# EAGLE design gate-feather (EAGLE 9.6.2)
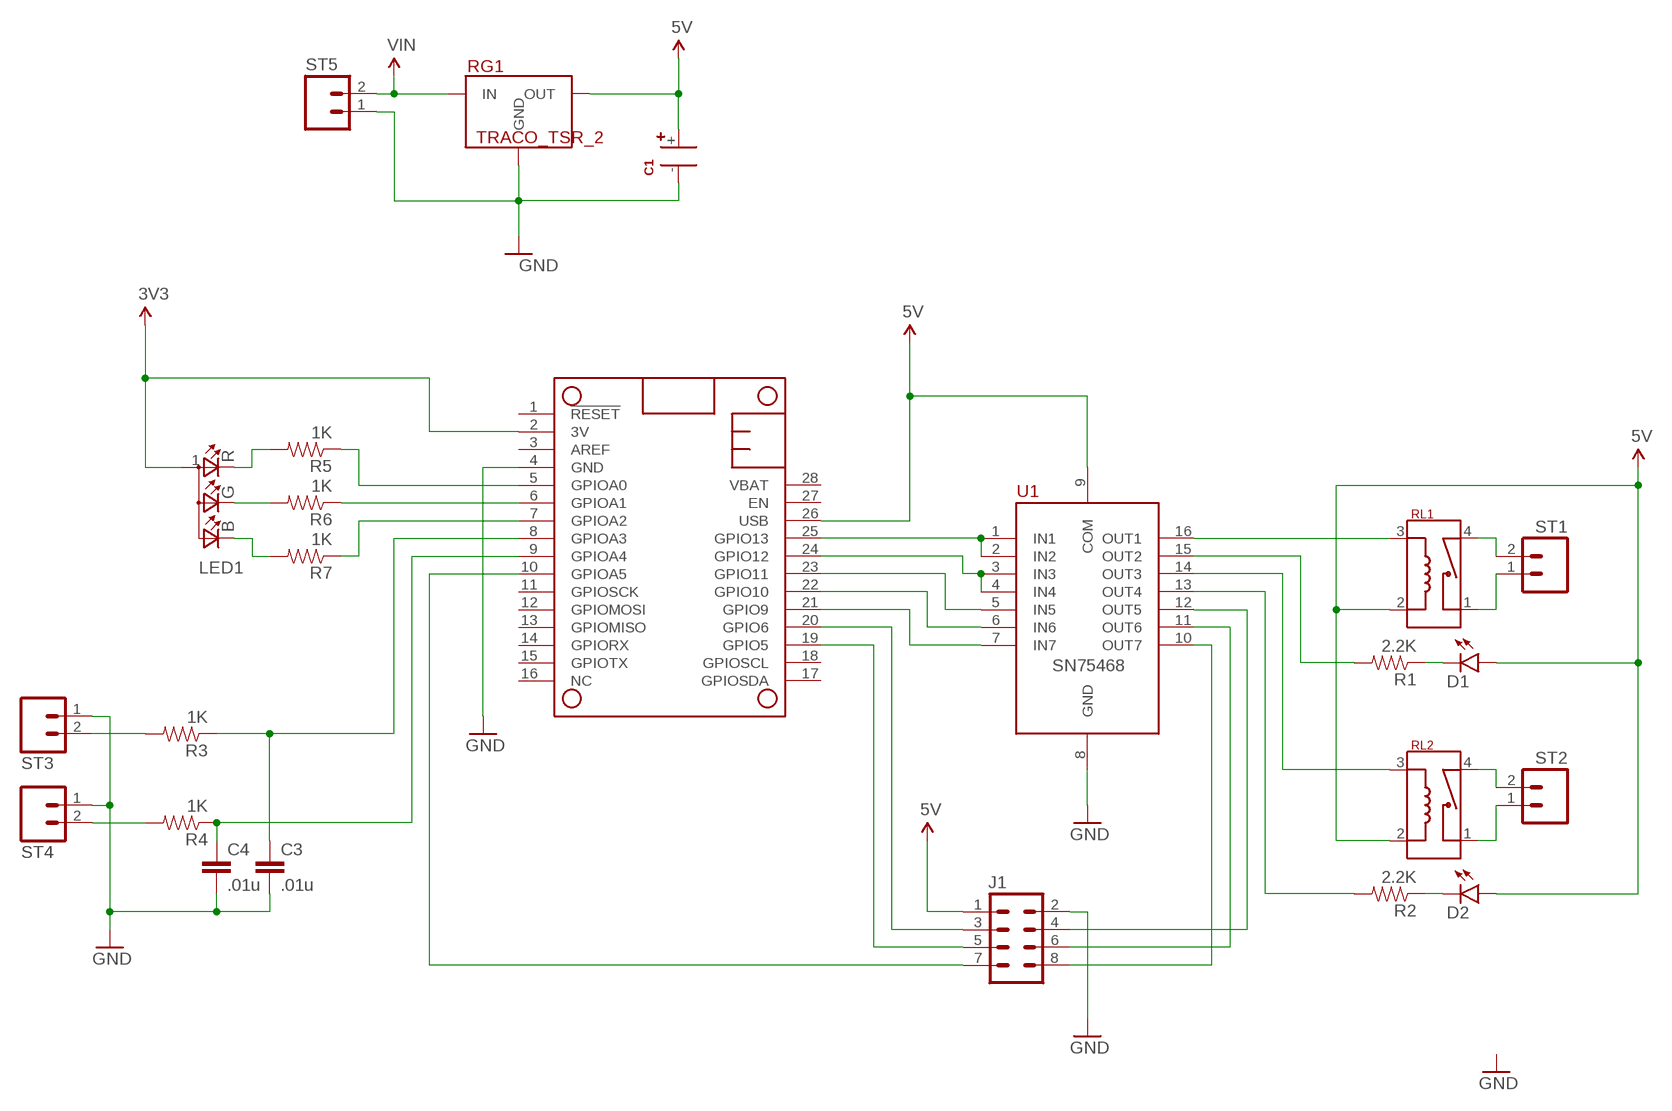
[diagram p0: schematic, sheet 1]

## Parts
C1  CAPACITOR-AXIAL10X25  [CAP-AXIAL-10X25]
C3  .01u  CAP0603-CAP  [0603-CAP]
C4  .01u  CAP0603-CAP  [0603-CAP]
D1  LED0603  [LED-0603]
D2  LED0603  [LED-0603]
J1  M04X2  [2X4]
LED1  LED-RGB-CREE-SMD  [LED-RGB-CREE-SMD]
MS1  FEATHERWING_NODIM  [FEATHERWING_DIM]
R1  2.2K  RESISTOR0603  [0603-RES]
R2  2.2K  RESISTOR0603  [0603-RES]
R3  1K  RESISTOR0603  [0603-RES]
R4  1K  RESISTOR0603  [0603-RES]
R5  1K  RESISTOR0603  [0603-RES]
R6  1K  RESISTOR0603  [0603-RES]
R7  1K  RESISTOR0603  [0603-RES]
RG1  TRACO_TSR_2  [TRACO_TSR_2]
RL1  HE3600_RELAY  [HE3600_RELAY]
RL2  HE3600_RELAY  [HE3600_RELAY]
ST1  SCREWTERM_2  [SCREWTERM_0.2X2]
ST2  SCREWTERM_2  [SCREWTERM_0.2X2]
ST3  SCREWTERM_2  [SCREWTERM_0.2X2]
ST4  SCREWTERM_2  [SCREWTERM_0.2X2]
ST5  SCREWTERM_2  [SCREWTERM_0.2X2]
U1  SN75468  [SOIC16]

## Nets
3V3: LED1.1(A) MS1.2(3V)
5V: C1.+ D1.A D2.A J1.1 MS1.26(USB) RG1.3(OUT) RL1.2(R1) RL2.2(R1) U1.9(COM)
GND: C1.- C3.2 C4.2 J1.2 MS1.4(GND) RG1.2(GND) ST3.1 ST4.1 ST5.1 U1.8(GND)
L5: J1.4 U1.12(OUT5)
L6: J1.6 U1.11(OUT6)
L7: J1.8 U1.10(OUT7)
N$1: D2.C R2.1
N$2: RL1.4(C2) ST1.2
N$3: D1.C R1.1
N$4: RL2.4(C2) ST2.2
N$5: R2.2 U1.13(OUT4)
N$6: R1.2 U1.15(OUT2)
N$7: C4.1 MS1.9(GPIOA4) R4.1
N$8: MS1.23(GPIO11) U1.5(IN5)
N$9: RL2.1(C1) ST2.1
N$10: LED1.4(R) R5.2
N$11: LED1.3(G) R6.2
N$12: LED1.2(B) R7.2
N$13: RL1.1(C1) ST1.1
N$15: MS1.6(GPIOA1) R6.1
N$16: MS1.5(GPIOA0) R5.1
N$17: R4.2 ST4.2
N$18: R3.2 ST3.2
N$19: MS1.7(GPIOA2) R7.1
N$20: J1.3 MS1.20(GPIO6)
N$21: MS1.22(GPIO10) U1.6(IN6)
N$22: RL2.3(R2) U1.14(OUT3)
N$23: MS1.21(GPIO9) U1.7(IN7)
N$24: J1.5 MS1.19(GPIO5)
N$25: J1.7 MS1.10(GPIOA5)
N$26: MS1.25(GPIO13) U1.1(IN1) U1.2(IN2)
N$27: MS1.24(GPIO12) U1.3(IN3) U1.4(IN4)
N$31: C3.1 MS1.8(GPIOA3) R3.1
N$33: RL1.3(R2) U1.16(OUT1)
VIN: RG1.1(IN) ST5.2
Unconnected: MS1.1(!RESET) MS1.3(AREF) MS1.11(GPIOSCK) MS1.12(GPIOMOSI) MS1.13(GPIOMISO) MS1.14(GPIORX) MS1.15(GPIOTX) MS1.16(NC) MS1.17(GPIOSDA) MS1.18(GPIOSCL) MS1.27(EN) MS1.28(VBAT)

## Library data of the parts
C1 = Puffin:CAPACITOR-AXIAL
C3 C4 = SparkFun-Capacitors:CAP: Capacitor Standard 0603 ceramic capacitor, and 0.1" leaded capacitor.
D1 D2 = SparkFun-LED:LED: LEDs Standard schematic elements and footprints for 5mm, 3mm, 1206, and 0603 sized LEDs. 5mm - Spark Fun Electronics SKU : COM-00529 (and others)
J1 = SparkFun-Connectors:M04X2: .1" header, two rows of four.
LED1 = SomUSB1:LED-RGB-CREE-SMD: LED RGB DIFFUSED 4SMD $ 0.35 Cree CLMVB-FKA-CFHEHLCBB7A363 2mm 4-PLCC common anode RGB LED https://www.digikey.com/product-detail/en/cree-inc/CLMVB-FKA-CFHEHLCBB7A363/CLMVB-FKA-CFHEHLCBB7A363CT-ND/6138627 Red=68 ohm, Green/Blue=33 ohm @ 3.3V
MS1 = adafruit:FEATHERWING
R1-R7 = SparkFun-Resistors:RESISTOR: Resistor Basic schematic elements and footprints for 0603, 1206, and PTH resistors.
RG1 = Puffin:TRACO_TSR_2
RL1 RL2 = Puffin:HE3600_RELAY
ST1-ST5 = Puffin:SCREWTERM_2
U1 = Puffin:SN75468

## Board
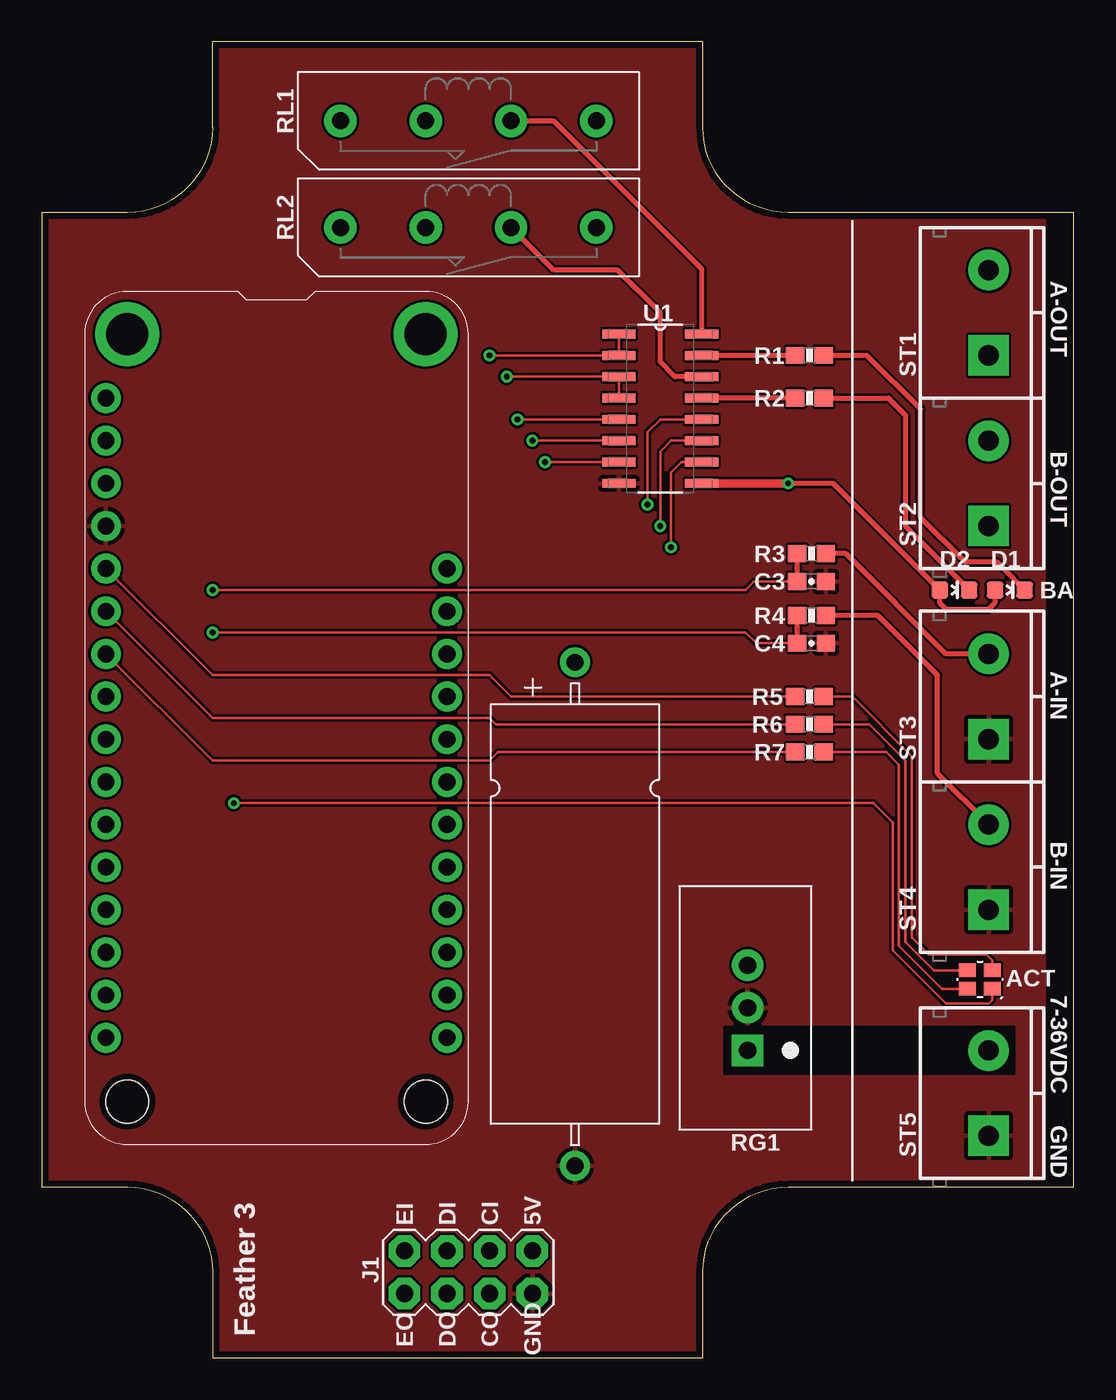
[diagram p1: board, top side]
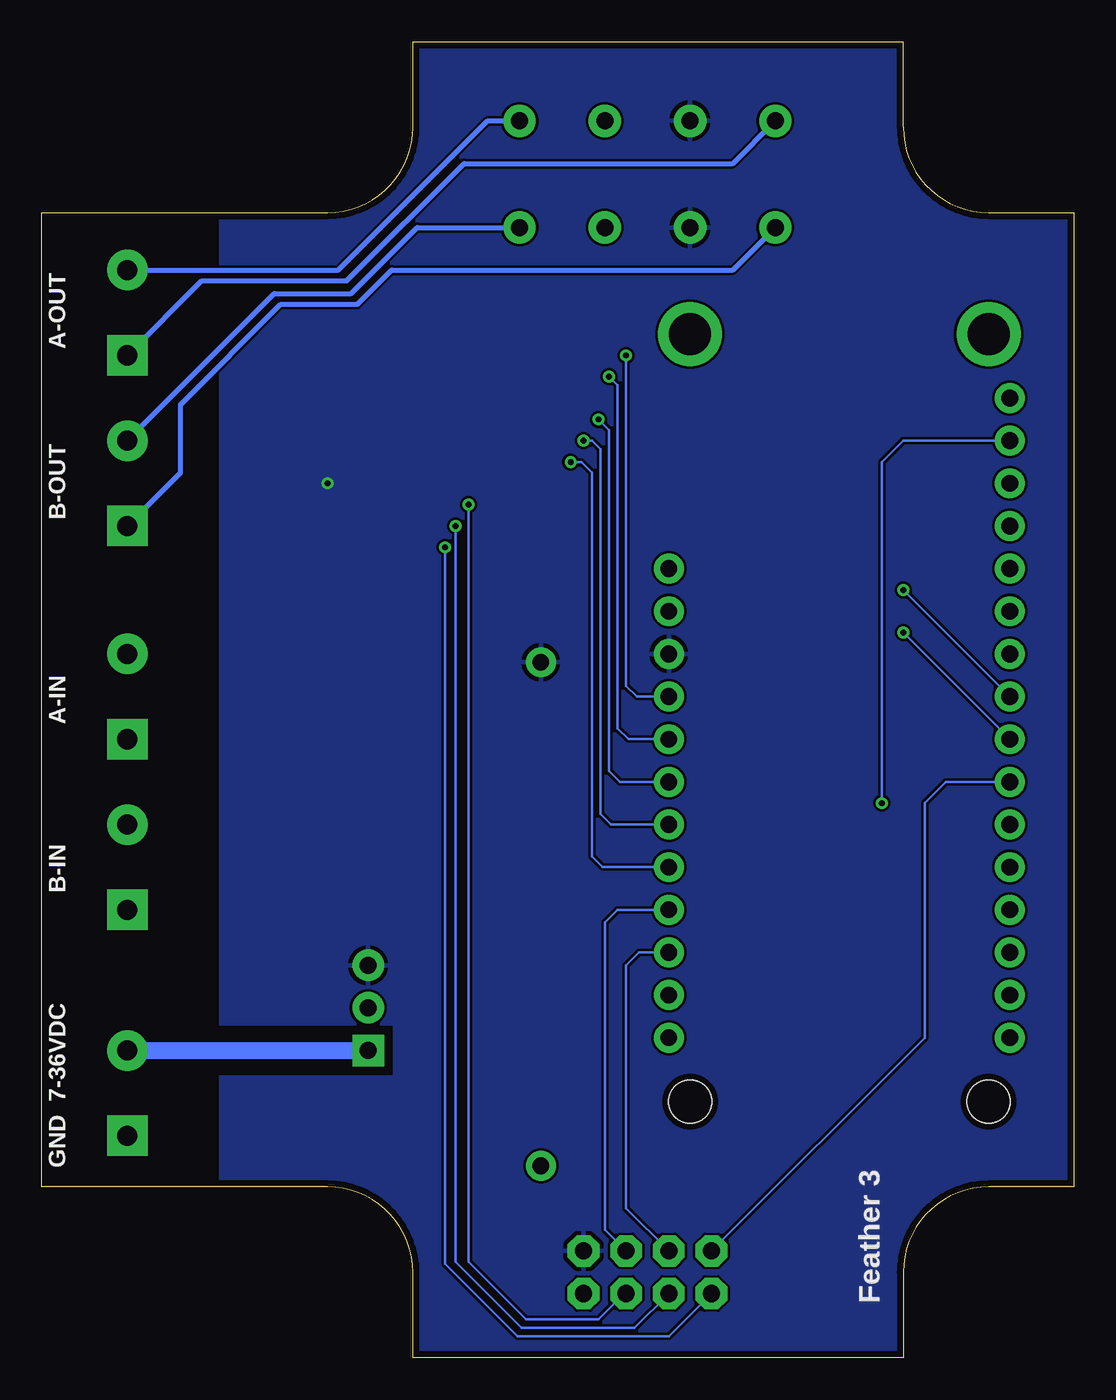
[diagram p2: board, bottom side, seen from below]

Size 61.47 x 78.36 mm. Coordinates in mm from the lower left corner, seen from the top.
Outline: 39.37,73.28 39.37,78.36 10.16,78.36 10.16,73.28 arc-90 5.08,68.2 0,68.2 0,10.16 5.08,10.16 arc-90 10.16,5.08 10.16,0 39.37,0 39.37,5.08 arc-90 44.45,10.16 61.47,10.16 61.47,68.2 44.45,68.2
Outline: 44.45,68.2 arc-90 39.37,73.28
Outline: 44.45,68.2 arc-90 39.37,73.28
Copper layers (1*16): Top 0.0356mm / dielectric 1.5011mm / Bottom 0.0356mm
Design rules "oshpark-2layer": minimum track width 6mil, minimum drill 13mil, track to track 6mil, track to pad 6mil, pad to pad 6mil, via to via 6mil, smd to smd 6mil, copper to edge 15mil, drill to drill 6mil, minimum pad ring 7mil, minimum via ring 7mil, stop-mask expansion 2.5mil, vias tented up to drill 0mil, thermal gap 10mil
tRestrict: area 40.6,16.9 to 57.9,19.7
bRestrict: area 40.6,16.9 to 51.1,19.7

### Footprints (pad centres in the part's own frame; a part is rotated, then mirrored left to right if it is on the bottom)
CAP-AXIAL-10X25 = drill 1 pad 1.778: + 15,0; - -15,0
0603-CAP = smd 1.1 x 1: 1 -0.85,0; 2 0.85,0
LED-0603 = smd 1 x 1: A 0,-0.877; C 0,0.877
2X4 = drill 1.016 pad 1.88 octagon: 1 -3.81,-1.27; 2 -3.81,1.27; 3 -1.27,-1.27; 4 -1.27,1.27; 5 1.27,-1.27; 6 1.27,1.27; 7 3.81,-1.27; 8 3.81,1.27
LED-RGB-CREE-SMD = smd 1 x 0.8: 1 1.5,0; 2 0,0; 3 0,1.1; 4 1.5,1.1
FEATHERWING_DIM = drill 1 pad 1.778: 1 6.35,1.27; 2 8.89,1.27; 3 11.43,1.27; 4 13.97,1.27; 5 16.51,1.27; 6 19.05,1.27; 7 21.59,1.27; 8 24.13,1.27; 9 26.67,1.27; 10 29.21,1.27; 11 31.75,1.27; 12 34.29,1.27; 13 36.83,1.27; 14 39.37,1.27; 15 41.91,1.27; 16 44.45,1.27; 17 44.45,21.59; 18 41.91,21.59; 19 39.37,21.59; 20 36.83,21.59; 21 34.29,21.59; 22 31.75,21.59; 23 29.21,21.59; 24 26.67,21.59; 25 24.13,21.59; 26 21.59,21.59; 27 19.05,21.59; 28 16.51,21.59 | drill 2.5 pad 3.81: P$1 2.54,20.32; P$2 2.54,2.54 | hole 2.54: 48.26,20.32; 48.26,2.54
0603-RES = smd 1.1 x 1: 1 -0.85,0; 2 0.85,0
TRACO_TSR_2 = drill 1.016 pad 1.88 square: 1 -2.54,0 | drill 1.016 pad 1.88: 2 0,0; 3 2.54,0
HE3600_RELAY = drill 1.016 pad 1.93: 1 0,0; 2 0,-5.08; 3 0,-10.16; 4 0,-15.24
SCREWTERM_0.2X2 = drill 1.2 pad 2.413 square: 1 0,0 | drill 1.2 pad 2.413: 2 5.08,0
SOIC16 = smd 1.981 x 0.533: 1 -2.464,4.445; 2 -2.464,3.175; 3 -2.464,1.905; 4 -2.464,0.635; 5 -2.464,-0.635; 6 -2.464,-1.905; 7 -2.464,-3.175; 8 -2.464,-4.445; 9 2.464,-4.445; 10 2.464,-3.175; 11 2.464,-1.905; 12 2.464,-0.635; 13 2.464,0.635; 14 2.464,1.905; 15 2.464,3.175; 16 2.464,4.445

### Placement (x,y rotation side)
C1  31.75,26.42 90 top
C3  45.85,46.23 0 top
C4  45.85,42.55 0 top
D1  57.66,45.72 270 top
D2  54.36,45.72 270 top
J1  25.4,5.08 180 top
LED1  55.12,21.97 0 top
MS1  2.54,63.5 270 top
R1  45.72,59.69 180 top
R2  45.72,57.15 180 top
R3  45.85,47.88 0 top
R4  45.85,44.2 0 top
R5  45.72,39.37 0 top
R6  45.72,37.72 0 top
R7  45.72,36.07 0 top
RG1  42.04,20.83 90 top
RL1  17.78,73.66 90 top
RL2  17.78,67.31 90 top
ST1  56.39,59.69 90 top
ST2  56.39,49.53 90 top
ST3  56.39,36.83 90 top
ST4  56.39,26.67 90 top
ST5  56.39,13.21 90 top
U1  36.83,56.52 0 top

### Tracks (layer width: path | path; a pad name or v marks a point on that pad's centre or on a via)
3V3  (via drill 0.35)
  Top 0.152: LED1.1 56.62,21.31 56.39,21.08 53.85,21.08 50.67,24.26 50.67,31.88 49.53,33.02 v11.43,33.02
  Bottom 0.152: v11.43,33.02 11.43,53.34 10.16,54.61 MS1.2
5V  (via drill 0.35)
  Top 0.305: D1.A 56.78,44.97 56.39,44.58 53.85,44.58 53.48,44.95 D2.A 47.13,52.07 v44.45,52.07
  Top 0.508: U1.9 v44.45,52.07
  pour Bottom: -1.27,80.01 -1.27,-1.27 50.8,-1.27 50.8,80.01
GND
  pour Top: 0,81.28 0,-1.27 59.69,-1.27 59.69,81.28
L5  (via drill 0.35)
  Top 0.152: U1.12 36.83,55.88 36.07,55.12 v36.07,50.8
  Bottom 0.152: v36.07,50.8 36.07,5.71 32.64,2.29 28.32,2.29 26.8,3.81 J1.4
L6  (via drill 0.35)
  Top 0.152: U1.11 37.47,54.61 36.83,53.98 v36.83,49.53
  Bottom 0.152: v36.83,49.53 36.83,5.71 32.89,1.78 26.16,1.78 J1.6
L7  (via drill 0.35)
  Top 0.152: U1.10 38.1,53.34 37.47,52.7 v37.47,48.26
  Bottom 0.152: v37.47,48.26 37.47,5.59 33.15,1.27 24.13,1.27 J1.8
N$1
  Top 0.305: R2.1 50.42,57.15 51.44,56.13 51.44,49.52 D2.C
N$2
  Bottom 0.305: ST1.2 43.81,64.77 34.92,73.66 RL1.4
N$3
  Top 0.305: D1.C 57.29,46.99 56.91,47.37 54.99,47.37 52.32,50.04 52.32,56.52 49.15,59.69 R1.1
N$4
  Bottom 0.305: ST2.2 47.62,63.37 43.05,63.37 39.12,67.31 RL2.4
N$5
  Top 0.305: R2.2 U1.13
N$6
  Top 0.305: R1.2 U1.15
N$7  (via drill 0.35)
  Top 0.152: C4.1 42.55,42.55 41.91,43.18 v10.16,43.18
  Top 0.305: C4.1 R4.1
  Bottom 0.152: v10.16,43.18 MS1.9
N$8  (via drill 0.35)
  Top 0.152: U1.5 v28.32,55.88
  Bottom 0.152: v28.32,55.88 27.69,55.24 27.69,34.92 27.05,34.29 MS1.23
N$9
  Bottom 0.305: ST2.1 53.21,52.7 53.21,56.77 47.24,62.74 42.67,62.74 40.64,64.77 20.32,64.77 RL2.1
N$10
  Top 0.152: R5.2 48.26,39.37 51.82,35.81 51.82,25.02 52.83,24 56.26,24 56.62,23.65 LED1.4
N$11
  Top 0.152: R6.2 49.28,37.72 51.44,35.56 51.44,24.77 53.13,23.07 LED1.3
N$12
  Top 0.152: LED1.2 53.59,21.97 51.05,24.51 51.05,35.31 50.29,36.07 R7.2
N$13
  Bottom 0.305: ST1.1 51.94,64.14 43.31,64.14 36.32,71.12 20.32,71.12 RL1.1
N$15
  Top 0.152: R6.1 27.05,37.72 26.67,38.1 10.16,38.1 MS1.6
N$16
  Top 0.152: R5.1 27.94,39.37 26.67,40.64 10.16,40.64 MS1.5
N$17
  Top 0.305: ST4.2 53.34,34.8 53.34,40.64 49.78,44.2 R4.2
N$18
  Top 0.305: ST3.2 53.85,41.91 47.88,47.88 R3.2
N$19
  Top 0.152: R7.1 27.18,36.07 26.67,35.56 10.16,35.56 MS1.7
N$20
  Bottom 0.152: MS1.20 27.18,26.67 27.94,25.91 27.94,7.62 J1.3
N$21  (via drill 0.35)
  Top 0.152: U1.6 v29.21,54.61
  Bottom 0.152: v29.21,54.61 28.7,54.61 28.19,54.1 28.19,32.38 27.56,31.75 MS1.22
N$22
  Top 0.305: U1.14 37.72,58.42 36.83,59.31 36.83,62.23 34.29,64.77 30.48,64.77 RL2.3
N$23  (via drill 0.35)
  Top 0.152: U1.7 v29.97,53.34
  Bottom 0.152: v29.97,53.34 29.34,53.34 28.7,52.7 28.7,29.84 28.07,29.21 MS1.21
N$24
  Bottom 0.152: MS1.19 25.91,24.13 26.67,23.37 26.67,8.89 J1.5
N$25
  Bottom 0.152: J1.7 8.89,19.05 8.89,33.02 7.62,34.29 MS1.10
N$26  (via drill 0.35)
  Top 0.152: U1.1 U1.2 v26.67,59.69
  Bottom 0.152: v26.67,59.69 26.67,40.01 26.04,39.37 MS1.25
N$27  (via drill 0.35)
  Top 0.152: v27.69,58.42 U1.3 U1.4
  Bottom 0.152: v27.69,58.42 27.18,57.91 27.18,37.47 26.54,36.83 MS1.24
N$31  (via drill 0.35)
  Top 0.152: C3.1 42.42,46.23 41.91,45.72 v10.16,45.72
  Top 0.305: C3.1 R3.1
  Bottom 0.152: v10.16,45.72 MS1.8
N$33
  Top 0.305: 39.37,61.04 U1.16 39.29,64.85 30.48,73.66 RL1.3
VIN
  Bottom 1.016: ST5.2 RG1.1

### Text on the board
tPlace: A-OUT | B-OUT | BA | A-IN | B-IN | ACT | 7-36VDC | GND | Feather 3
bPlace: A-OUT | B-OUT | A-IN | B-IN | 7-36VDC | Feather 3 | GND
tNames: EI | DI | CI | 5V | EO | DO | CO | GND